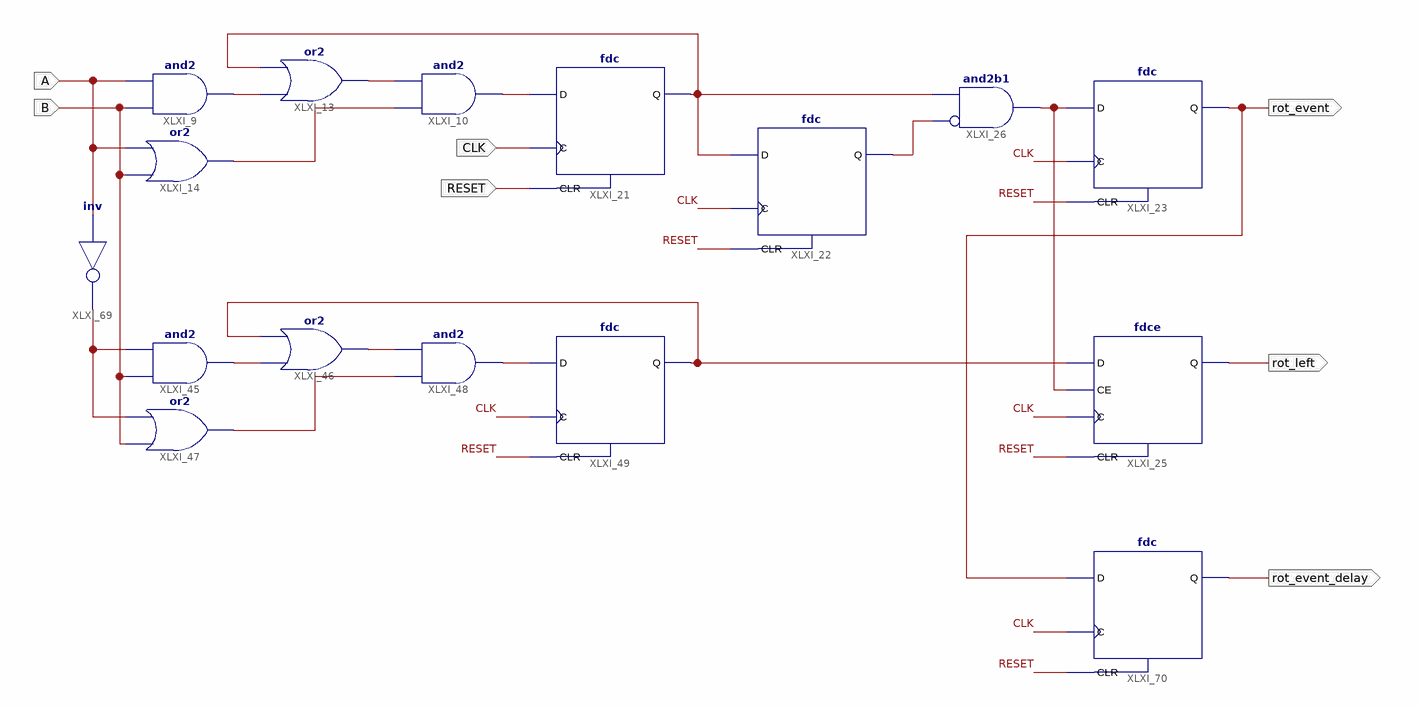
[diagram p0: schematic sheet 1]
// Xilinx ISE schematic debounceRotary.sch (spartan3e) as structural Verilog: 16 symbols, 7 ports
module debounceRotary (
  input  CLK,
  input  RESET,
  input  A,
  input  B,
  output rot_event,
  output rot_left,
  output rot_event_delay
);

  wire XLXN_1, XLXN_2, XLXN_3, XLXN_4, XLXN_8, XLXN_17, XLXN_23, XLXN_24, XLXN_25, XLXN_26, XLXN_29, XLXN_43,
       XLXN_47;

  and XLXI_9 (XLXN_1, B, A);
  or XLXI_13 (XLXN_2, XLXN_1, XLXN_17);
  or XLXI_14 (XLXN_3, B, A);
  and XLXI_10 (XLXN_4, XLXN_3, XLXN_2);
  fdc XLXI_21 (.C(CLK), .CLR(RESET), .D(XLXN_4), .Q(XLXN_17));
  and XLXI_26 (XLXN_47, ~XLXN_8, XLXN_17);  // and2b1
  fdc XLXI_22 (.C(CLK), .CLR(RESET), .D(XLXN_17), .Q(XLXN_8));
  fdc XLXI_23 (.C(CLK), .CLR(RESET), .D(XLXN_47), .Q(rot_event));
  and XLXI_45 (XLXN_23, B, XLXN_29);
  or XLXI_46 (XLXN_24, XLXN_23, XLXN_43);
  or XLXI_47 (XLXN_25, B, XLXN_29);
  and XLXI_48 (XLXN_26, XLXN_25, XLXN_24);
  fdc XLXI_49 (.C(CLK), .CLR(RESET), .D(XLXN_26), .Q(XLXN_43));
  fdce XLXI_25 (.C(CLK), .CE(XLXN_47), .CLR(RESET), .D(XLXN_43), .Q(rot_left));
  not XLXI_69 (XLXN_29, A);
  fdc XLXI_70 (.C(CLK), .CLR(RESET), .D(rot_event), .Q(rot_event_delay));
endmodule
